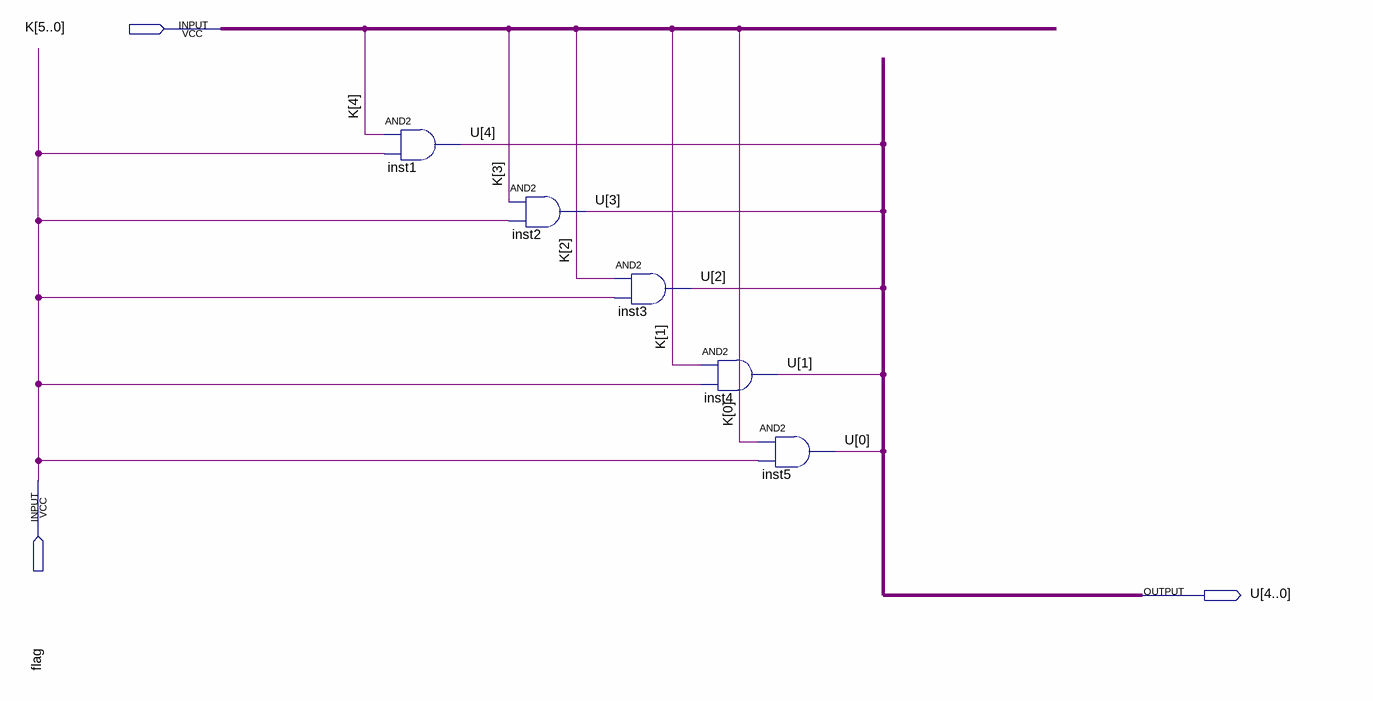
[diagram p0: schematic sheet]
// Quartus schematic DisplayVerifica.bdf as structural Verilog: 5 symbols, 3 pins
module DisplayVerifica (
  input  [5:0] K,
  input  flag,
  output [4:0] U
);

  and inst1 (U[4], K[4], flag);
  and inst2 (U[3], K[3], flag);
  and inst3 (U[2], K[2], flag);
  and inst4 (U[1], K[1], flag);
  and inst5 (U[0], K[0], flag);
endmodule
